# Altium schematic sheet 51-2001-01-12_04 Power Module Schematic.SchDoc
size 431 x 279 mm; Organization: ORGANIZATION; Address1: ADDRESS 1; Address2: ADDRESS 2; Address3: ADDRESS 3; Address4: ADDRESS 4; Revision: -; SheetNumber: 4; SheetTotal: 4; ENG_APP_DATE: --/--/--; DSN_APP_DATE: --/--/--; CHK_APP_DATE: --/--/--
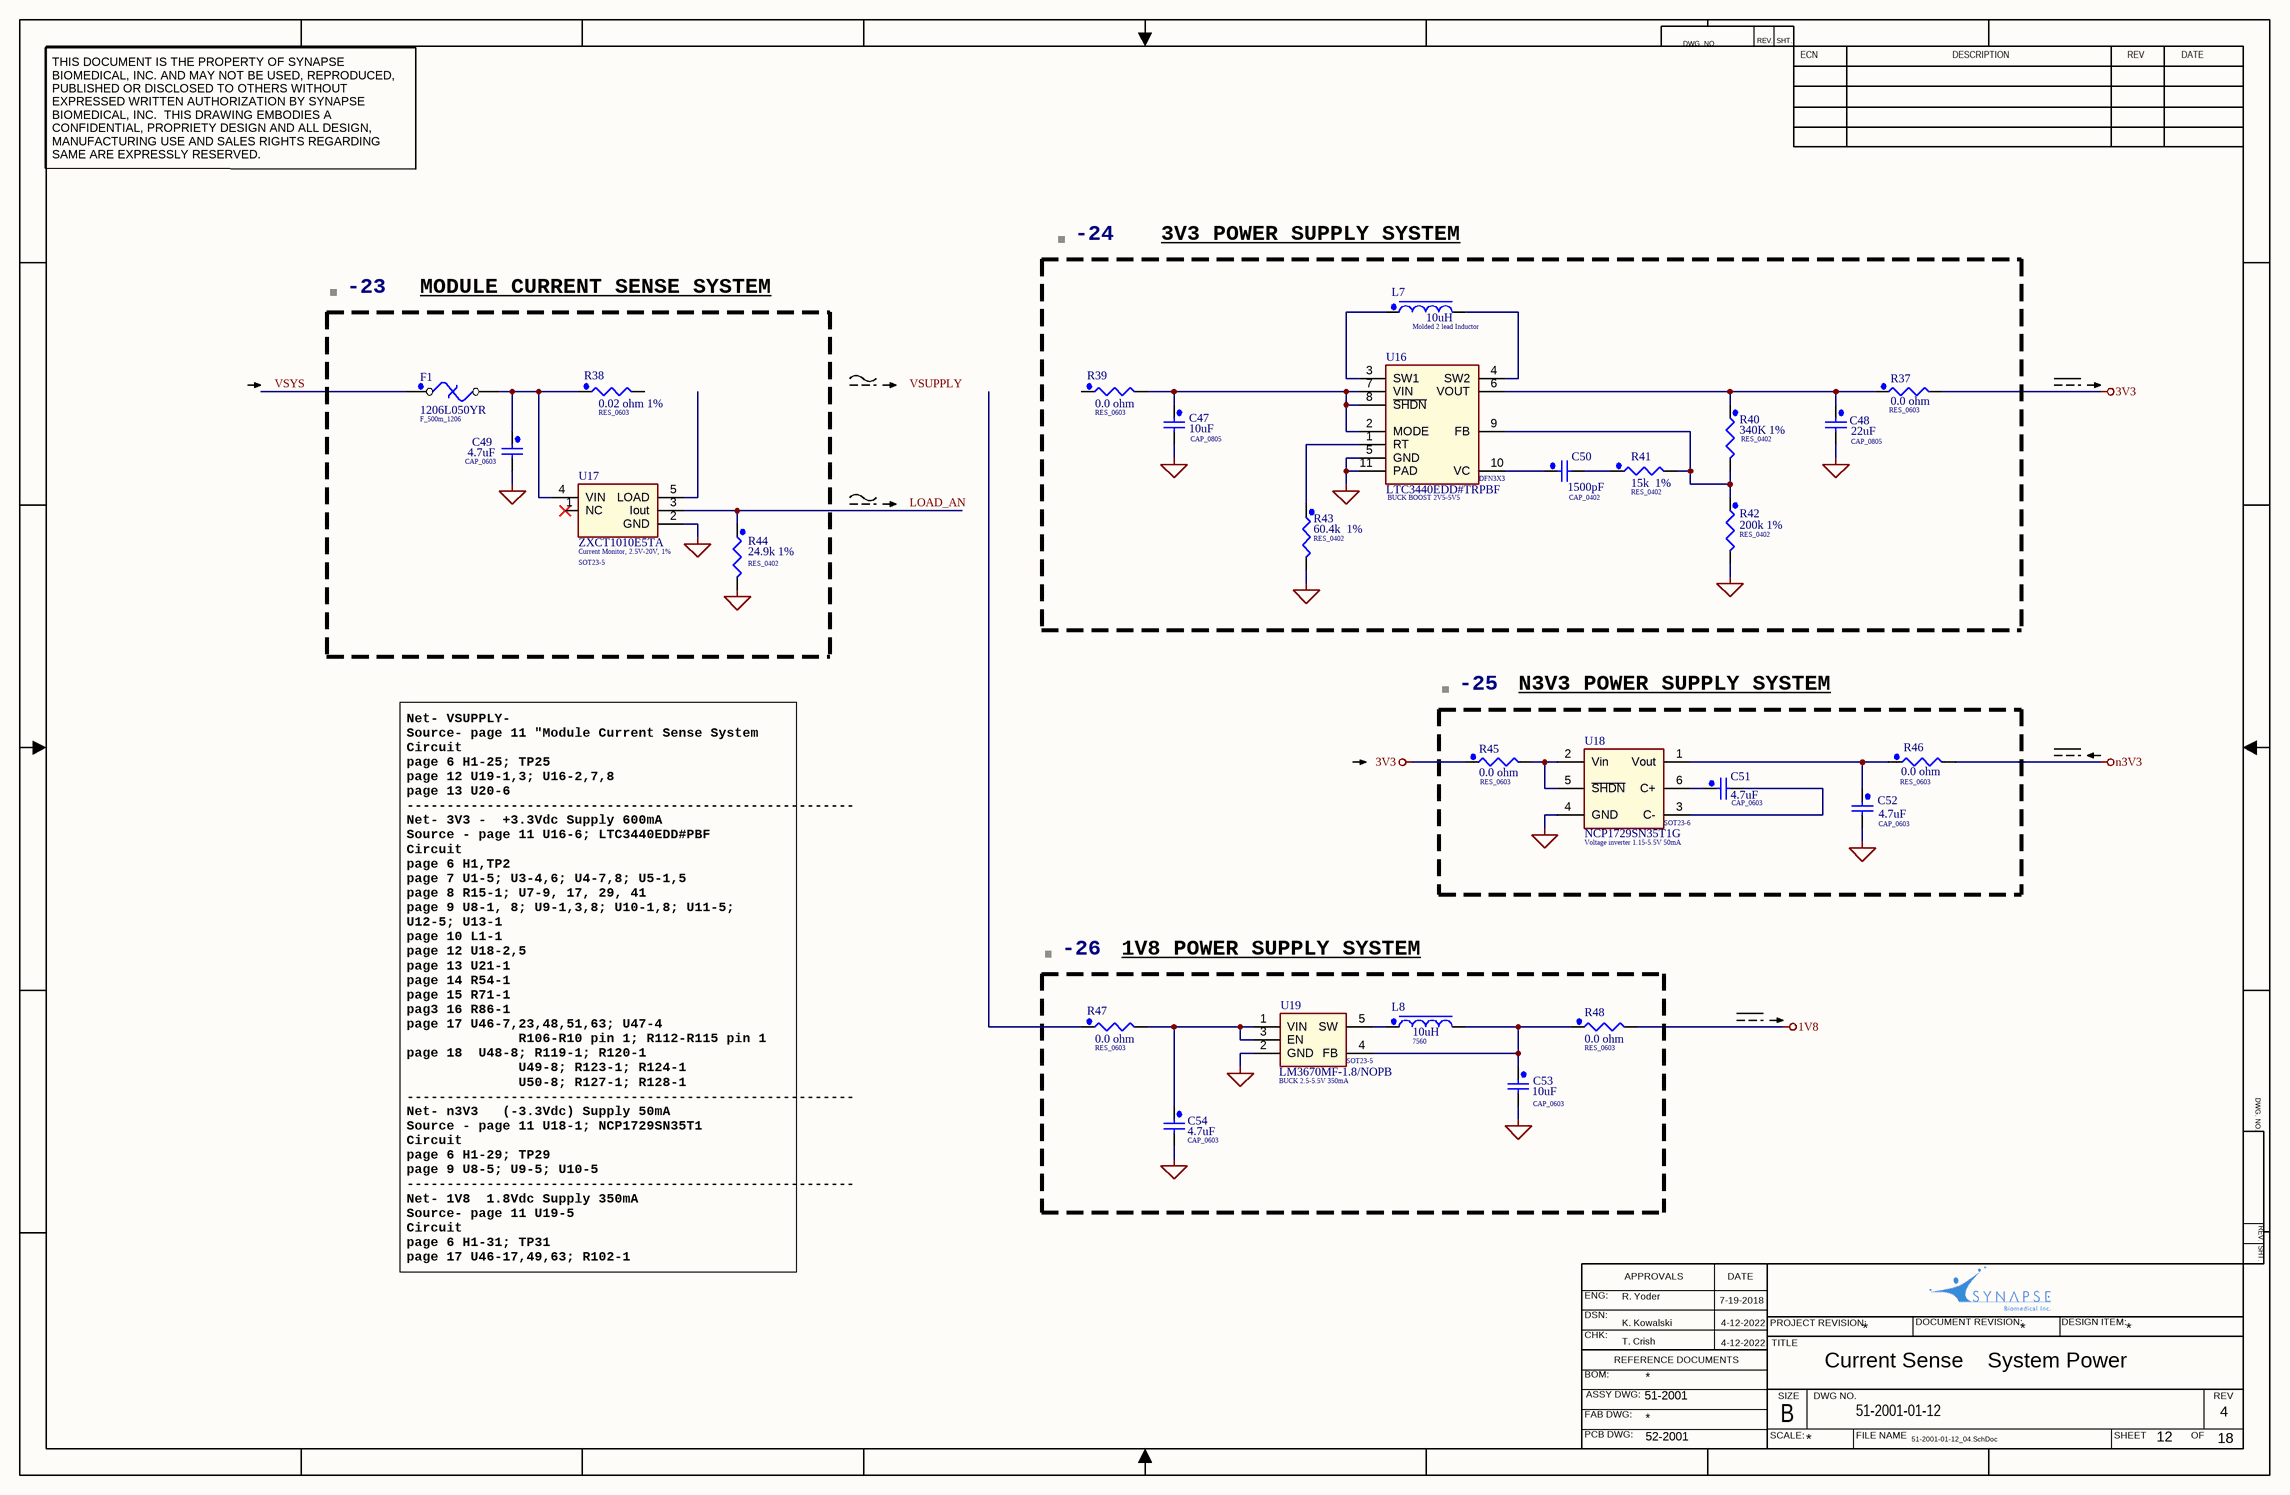
[diagram p0: 51-2001-01-12_04 Power Module Schematic.SchDoc]

## Parts
-23  XDESCRIPTION: MODULE CURRENT SENSE SYSTEM  (hidden comment: BOM_S1)  (graphical)
-24  XDESCRIPTION: 3V3 POWER SUPPLY SYSTEM  (hidden comment: BOM_S1)  (graphical)
-25  XDESCRIPTION: N3V3 POWER SUPPLY SYSTEM  (hidden comment: BOM_S1)  (graphical)
-26  XDESCRIPTION: 1V8 POWER SUPPLY SYSTEM  (hidden comment: BOM_S1)  (graphical)
C47  value 10uF  [CAP_0805]  (hidden comment: C_10u_X5R_16_0805_10%)
C48  value 22uF  [CAP_0805]  (hidden comment: C_22u_X5R_6V3_0805_20%)
C49  value 4.7uF  [CAP_0603]  (hidden comment: C_4u7_X5R_10_0603_10%)
C50  value 1500pF  [CAP_0402]  (hidden comment: C_1n5_X7R_50_0402_10%)
C51  value 4.7uF  [CAP_0603]  (hidden comment: C_4u7_X5R_10_0603_10%)
C52  value 4.7uF  [CAP_0603]  (hidden comment: C_4u7_X5R_10_0603_10%)
C53  value 10uF  [CAP_0603]  (hidden comment: C_10u_X5R_6V3_0603_20%)
C54  value 4.7uF  [CAP_0603]  (hidden comment: C_4u7_X5R_10_0603_10%)
F1  F_500m_1206  [FUSE_1206]
L7  value 10uH  PackageDescription: Molded 2 lead Inductor  [IND-P1166NL]  (hidden comment: L_10u_1A6_3030_20%)
L8  value 10uH  PackageDescription: 7560  [IND-ELL-6RH]  (hidden comment: L_10u_1A1_2626_20%)
R37  value 0.0 ohm  [RES_0603]  (hidden comment: R_0_0603)
R38  value 0.02 ohm 1%  [RES_0603]  (hidden comment: R_20m_0603)
R39  value 0.0 ohm  [RES_0603]  (hidden comment: R_0_0603)
R40  value 340K 1%  [RES_0402]  (hidden comment: R_340k_0402)
R41  value 15k  1%  [RES_0402]  (hidden comment: R_15k_0402)
R42  value 200k 1%  [RES_0402]  (hidden comment: R_200k_0402)
R43  value 60.4k  1%  [RES_0402]  (hidden comment: R_60k4_0402)
R44  value 24.9k 1%  [RES_0402]  (hidden comment: R_24k9_0402)
R45  value 0.0 ohm  [RES_0603]  (hidden comment: R_0_0603)
R46  value 0.0 ohm  [RES_0603]  (hidden comment: R_0_0603)
R47  value 0.0 ohm  [RES_0603]  (hidden comment: R_0_0603)
R48  value 0.0 ohm  [RES_0603]  (hidden comment: R_0_0603)
U16  BUCK BOOST 2V5-5V5  PackageDescription: DFN3X3  MPN: LTC3440EDD#TRPBF  [DFN10]
U17  Current Monitor, 2.5V-20V, 1%  [SOT23-5]
U18  Voltage inverter 1.15-5.5V 50mA  MPN: NCP1729SN35T1G  [SOT23-6]
U19  BUCK 2.5-5.5V 350mA  MPN: LM3670MF-1.8/NOPB  [SOT23-5]

## Nets
1V8: R48.2
3V3: R37.2 R45.1
GND: C47.2 C48.2 C49.2 C52.2 C53.2 C54.2 R42.2 R43.2 R44.2 U16.5(GND) U16.11(PAD) U17.2(GND) U18.4(GND) U19.2(GND)
n3V3: R46.2
LOAD_AN: R44.1 U17.3(Iout)
VSYS: F1.1
NetC47_1: C47.1 R39.2 U16.2(MODE) U16.7(VIN) U16.8(~{SHDN})
NetC48_1: C48.1 R37.1 R40.1 U16.6(VOUT)
NetC49_1: C49.1 F1.2 R38.1 U17.4(VIN)
NetC50_1: C50.1 U16.10(VC)
NetC50_2: C50.2 R41.1
NetC51_1: C51.1 U18.6(C+)
NetC51_2: C51.2 U18.3(C-)
NetC52_1: C52.1 R46.1 U18.1(Vout)
NetC53_1: C53.1 L8.2 R48.1 U19.4(FB)
NetC54_1: C54.1 R47.2 U19.1(VIN) U19.3(EN)
NetL7_1: L7.1 U16.3(SW1)
NetL7_2: L7.2 U16.4(SW2)
NetL8_1: L8.1 U19.5(SW)
NetR40_2: R40.2 R41.2 R42.1 U16.9(FB)
NetR43_1: R43.1 U16.1(RT)
NetR45_2: R45.2 U18.2(Vin) U18.5(~{SHDN})

Not connected (* = marked no-connect by the designer): R38 2; R39 1; R47 1; U17 1(NC)* 5(LOAD)

## Notes on the sheet
- DWG. NO.
- REV.
- SHT.
- ECN
- DESCRIPTION
- REV
- DATE
- THIS DOCUMENT IS THE PROPERTY OF SYNAPSE BIOMEDICAL, INC. AND MAY NOT BE USED, REPRODUCED, PUBLISHED OR DISCLOSED TO OTHERS WITHOUT EXPRESSED WRITTEN AUTHORIZATION BY SYNAPSE BIOMEDICAL, INC.  THIS DRAWING EMBODIES A CONFIDENTIAL, PROPRIETY DESIGN AND ALL DESIGN, MANUFACTURING USE AND SALES RIGHTS REGARDING SAME ARE EXPRESSLY RESERVED.
- Net- VSUPPLY-
  Source- page 11 "Module Current Sense System
  Circuit
  page 6 H1-25; TP25
  page 12 U19-1,3; U16-2,7,8
  page 13 U20-6
  --------------------------------------------------------
  Net- 3V3 -  +3.3Vdc Supply 600mA
  Source - page 11 U16-6; LTC3440EDD#PBF
  Circuit
  page 6 H1,TP2
  page 7 U1-5; U3-4,6; U4-7,8; U5-1,5
  page 8 R15-1; U7-9, 17, 29, 41
  page 9 U8-1, 8; U9-1,3,8; U10-1,8; U11-5; U12-5; U13-1
  page 10 L1-1
  page 12 U18-2,5
  page 13 U21-1
  page 14 R54-1
  page 15 R71-1
  pag3 16 R86-1
  page 17 U46-7,23,48,51,63; U47-4
  R106-R10 pin 1; R112-R115 pin 1
  page 18  U48-8; R119-1; R120-1
  U49-8; R123-1; R124-1
  U50-8; R127-1; R128-1
  --------------------------------------------------------
  Net- n3V3   (-3.3Vdc) Supply 50mA
  Source - page 11 U18-1; NCP1729SN35T1
  Circuit
  page 6 H1-29; TP29
  page 9 U8-5; U9-5; U10-5
  --------------------------------------------------------
  Net- 1V8  1.8Vdc Supply 350mA
  Source- page 11 U19-5
  Circuit
  page 6 H1-31; TP31
  page 17 U46-17,49,63; R102-1
- ENG:
- R. Yoder
- APPROVALS
- 7-19-2018
- DSN:
- CHK:
- REFERENCE DOCUMENTS
- K. Kowalski
- T. Crish
- 4-12-2022
- PROJECT REVISION:
- TITLE
- Current Sense    System Power
- *
- DOCUMENT REVISION:
- DESIGN ITEM:
- BOM:
- FAB DWG:
- PCB DWG:
- ASSY DWG:
- 51-2001
- SCALE:
- SIZE
- B
- DWG NO.
- 51-2001-01-12
- FILE NAME
- SHEET
- OF
- 4
- 52-2001
- 51-2001-01-12_04.SchDoc
- 12
- 18
- Labels drawn without touching a wire or pin: VSUPPLY

## Library data of the parts
-23--26 = BOM_S1: BOM item small graphic
C47 = EMK212BJ106KG-T: 10uF, 16V, X5R, 10%, 0805, RoHS; MFR: Murata Electronics North America; MPN: GRM21BR61C106KE15L; SBI: 53-0081; PackageDescription: CAP_0805; Supplier 1: Digi-Key; Supplier Part Number 1: 490-3886-6-ND
C48 = ECJ-2FB0J226M: 22uF, 6.3V, X5R, 20%, 0805,RoHS; MFR: Murata Electronics North America; MPN: GRM21BR60J226ME39L; SBI: 53-0082; PackageDescription: CAP_0805; Supplier 1: Digi-Key; Supplier Part Number 1: 490-1719-6-ND; MFR2: Murata Electronics North America; MPN2: GRM219R60J226ME47D; Parameter 1: *
C49 C51 C52 C54 = LMK107BJ475KA-T: 4.7uF, 10V, X5R, 10%, 0603, RoHS; MFR: Murata Electronics North America; MPN: GRM185R61A475KE11D; SBI: 53-0076; PackageDescription: CAP_0603; Supplier 1: Digi-Key; Supplier Part Number 1: 490-11988-6-ND
C50 = ECJ-0EB1H152K: 1500pF, 50V, X7R, 10%, 0402, RoHS; MFR: Murata Electronics North America; MPN: GRM155R71H152KA01D; SBI: 53-0083; PackageDescription: CAP_0402; Supplier 1: Digi-Key; Supplier Part Number 1: 490-3245-6-ND
C53 = ECJ-1VB0J106M: 10uF, 6.3V, X5R, 0603_20%, RoHS; MFR: Murata Electronics North America; MPN: GRM188R60J106ME47J; SBI: 53-0039; PackageDescription: CAP_0603; Supplier 1: Digi-Key; Supplier Part Number 1: 490-6405-6-ND
F1 = 1206L050YR: PTC Resettable, 500mA, 0.4 ohm,  6V, 1206, RoHS; MFR: Littelfuse; SBI: 54-0113; PackageDescription: F_500m_1206; Supplier 1: Digi-Key; Supplier Part Number 1: F2112CT-ND; Value: 500mA; MPN: 1206L050YR
L7 = P1166.103T: 10uH, 1.6A, 20%, 3030, RoHS; MFR: Pulse; SBI: 54-0115; Supplier 1: Mouser; Supplier Part Number 1: 673-P1166.103T; MPN: P1166.103T
L8 = ELL6RH100M: 10uH, 1.1A, 2626, 20%, RoHS; MFR: Panasonic; SBI: 54-0116; Supplier 1: Digi-Key; Supplier Part Number 1: PCD1345CT-ND; MPN: ELL6RH100M
R37 R39 R45-R48 = MCR03ERTJ000: 0.0 ohm, 1/16W, 0603, RoHS; MFR: Vishay Dale; MPN: CRCW06030000Z0EA; SBI: 53-0075; PackageDescription: RES_0603; Supplier 1: Digi-Key; Supplier Part Number 1: 541-1.00KLDKR-ND
R38 = WSL0603R0200FEA: 0.02 ohm, 1%, 1/10W, 0603, RoHS; MFR: Vishay Dale; SBI: 53-0087; PackageDescription: RES_0603; Supplier 1: Digi-Key; Supplier Part Number 1: WSLJ-.02DKR-ND; MPN: WSL0603R0200FEA
R40 = CRCW0402340KFKED: 340k ohm, 1%, 1/16W, 0402, RoHS; MFR: Vishay Dale; SBI: 51-0049-26; PackageDescription: RES_0402; Supplier 1: Digi-Key; Supplier Part Number 1: 541-340KLDKR-ND; MPN: CRCW0402340KFKED
R41 = MCR01MZPF1502: 15.0k ohm, 1%, 1/16W, smd, 0402, RoHS; MFR: Vishay Dale; MPN: CRCW040215K0FKED; SBI: 53-0049-27; PackageDescription: RES_0402; Supplier 1: Digi-Key; Supplier Part Number 1: 541-15.0KLDKR-ND
R42 = MCR01MZPF2003: 200k ohm, 1%, 1/16W, 0402, RoHS; MFR: Vishay Dale; MPN: CRCW0402200KFKED; SBI: 53-0049-28; PackageDescription: RES_0402; Supplier 1: Digi-Key; Supplier Part Number 1: 541-200KLDKR-ND
R43 = MCR01MZPF6042: 60.4k ohm, 1%, 1/16W, 0402, RoHS; MFR: Vishay Dale; MPN: CRCW040260K4FKED; SBI: 53-0049-29; PackageDescription: RES_0402; Supplier 1: Digi-Key; Supplier Part Number 1: 541-60.4KLDKR-ND
R44 = MCR01MZPF2492: 24.9k ohm, 1%, 1/16W, 0402, RoHS; MFR: Vishay Dale; MPN: CRCW040224K9FKED; SBI: 53-0049-30; PackageDescription: RES_0402; Supplier 1: Digi-Key; Supplier Part Number 1: 541-24.9KLDKR-ND
U16 = LTC3440EDD: Buck Boost DC/DC, 600mA, DFN, RoHS; MFR: Linear Technology; SBI: 54-0097; Supplier 1: Digi-Key; Supplier Part Number 1: LTC3440EDD#PBF-ND; MPN2: LTC3440EDD#PBF
U17 = ZXCT1010E5TA: Current Monitor, 2.5V-20V, 1%, RoHS; MFR: Diodes Incorporated; SBI: 54-0052; ComponentLink1URL: Q:\00\04\00-04-3500 Zetex ZXCT1010.pdf; ComponentNNPS_PN: 00-04-3500; PackageDescription: SOT23-5; Supplier 1: Digi-Key; Supplier Part Number 1: ZXCT1010DKR-ND; Value: ZXCT1010; MPN: ZXCT1010E5TA
U18 = NCP1729SN35T1: Voltage inverter, 1.15-5.5V, 50mA, SOT23-6, RoHS; MFR: ON Semiconductor; SBI: 54-0079; Supplier 1: Digi-Key; Supplier Part Number 1: NCP1729SN35T1GOSDKR-ND; PackageDescription: SOT23-6
U19 = LM3670MF-1.8: Buck Boost, DC/DC, 350mA, SOT23-5, RoHS; MFR: Texas Instruments; SBI: 54-0098; Supplier Part Number 1: LM3670MF-1.8/NOPBDKR-ND; Supplier 1: Digi-Key; PackageDescription: SOT23-5